# Altium schematic sheet [03] - LED7SEG.SchDoc
size A3
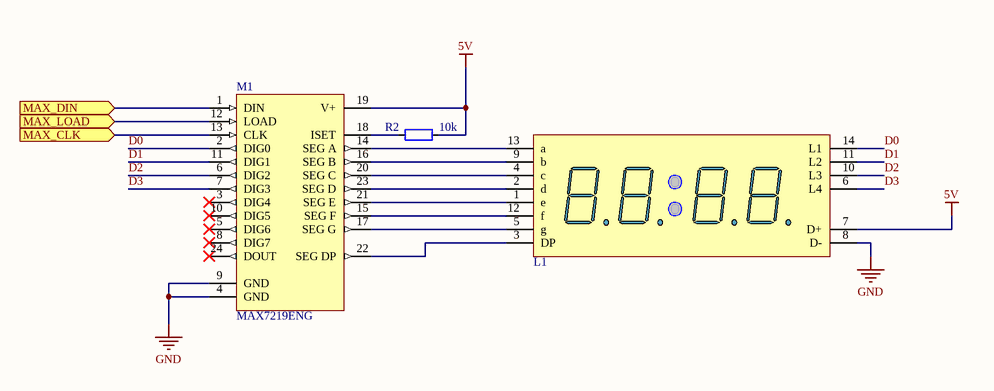
[diagram p0: [03] - LED7SEG.SchDoc]

## Parts
L1  Led 7 Seg 4 digit - Anode  [LED7SEG-4-0.56-RG]  (value not drawn)
M1  MAX7219ENG  [DIP24/W0.3]
R2  10k  [RES-SMD-0805]

## Ports
MAX_CLK (in), MAX_DIN (in), MAX_LOAD (in)

## Nets
5V: L1.7(D+) M1.19(V+) R2.2
GND: L1.8(D-) M1.4(GND) M1.9(GND)
D0: L1.14(L1) M1.2(DIG0)
D1: L1.11(L2) M1.11(DIG1)
D2: L1.10(L3) M1.6(DIG2)
D3: L1.6(L4) M1.7(DIG3)
MAX_CLK: M1.13(CLK) ; port MAX_CLK
MAX_DIN: M1.1(DIN) ; port MAX_DIN
MAX_LOAD: M1.12(LOAD) ; port MAX_LOAD
NetL1_1: L1.1(e) M1.21(SEG_E)
NetL1_2: L1.2(d) M1.23(SEG_D)
NetL1_3: L1.3(DP) M1.22(SEG_DP)
NetL1_4: L1.4(c) M1.20(SEG_C)
NetL1_5: L1.5(g) M1.17(SEG_G)
NetL1_9: L1.9(b) M1.16(SEG_B)
NetL1_12: L1.12(f) M1.15(SEG_F)
NetL1_13: L1.13(a) M1.14(SEG_A)
NetM1_18: M1.18(ISET) R2.1

Not connected (* = marked no-connect by the designer): M1 3(DIG4)* 5(DIG6)* 8(DIG7)* 10(DIG5)* 24(DOUT)*

## Library data of the parts
L1 = LED7SEG-4-RG
M1 = MAX7219ENG: Serially Interfaced, 8-Digit LED Display Driver; Published: 16-Jan-2001; LatestRevisionDate: 29-May-2009; LatestRevisionNote: Component Body Added.; DatasheetVersion: Jul-1997; PackageVersion: 1997; PackageReference: NG24A; Publisher: Altium Limited; PackageDescription: DIP, 24-Pin, Row Spacing 7.62 mm, Pitch 2.54 mm; Code_JEDEC: MS-001-AF; ComponentLink1Description: Manufacturer Link; ComponentLink1URL: http://www.maxim-ic.com/; ComponentLink2Description: Datasheet; ComponentLink2URL: http://pdfserv.maxim-ic.com/en/ds/MAX7219-MAX7221.pdf
R2 = Resistor - SMD: Resistor; Manufacturer: Generic Components; Class: Passive; Published: 08/06/2000; Publisher: Altium Hobart Technology Centre